# EAGLE schematic USBHostModule (EAGLE 9.6.2)
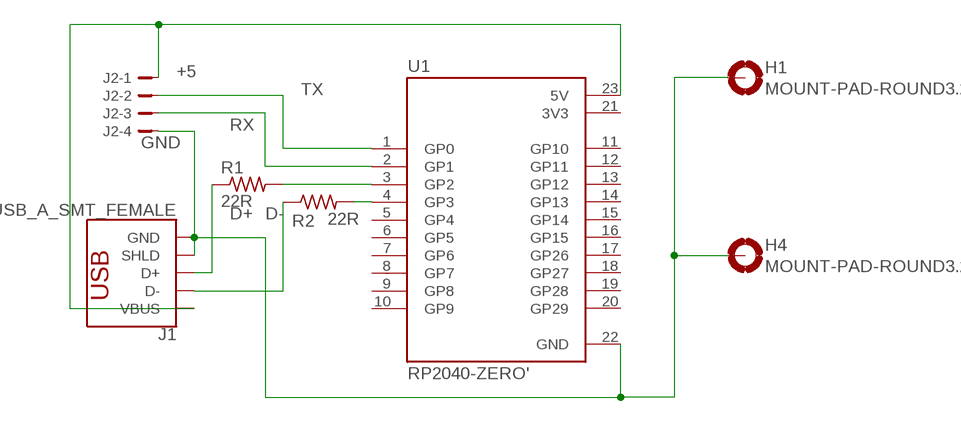
[diagram p0: schematic, sheet 1]

## Parts
H1  MOUNT-PAD-ROUND3.2  [3,2-PAD]
H4  MOUNT-PAD-ROUND3.2  [3,2-PAD]
J1  USB_A_SMT_FEMALE  [USB-A-S-SILK-FEMALE]
J2  JST-PH-4_TH-RA  [S4B-PH-KL]
R1  22R  R-US_R1206  [R1206]
R2  22R  R-US_R1206  [R1206]
U1  RP2040-ZERO'  [MODULE_RP2040-ZERO]

## Nets
+5: J1.VBUS J2.1 U1.23(5V)
D+: J1.D+ R1.1
D-: J1.D- R2.1
GND: H1.B3,2(MOUNT) H4.B3,2(MOUNT) J1.GND J1.SHLD1(SHLD) J1.SHLD2(SHLD) J2.4 U1.22(GND)
N$5: R2.2 U1.4(GP3)
N$6: R1.2 U1.3(GP2)
RX: J2.3 U1.2(GP1)
TX: J2.2 U1.1(GP0)
Unconnected: U1.5(GP4) U1.6(GP5) U1.7(GP6) U1.8(GP7) U1.9(GP8) U1.10(GP9) U1.11(GP10) U1.12(GP11) U1.13(GP12) U1.14(GP13) U1.15(GP14) U1.16(GP15) U1.17(GP26) U1.18(GP27) U1.19(GP28) U1.20(GP29)

## Power pins joined to a net without a drawn wire
3V3: U1.21(3V3)

## Library data of the parts
H1 H4 = holes:MOUNT-PAD-ROUND: MOUNTING PAD, round
J1 = SparkFun-Connectors:USB_A: USB-A Connector Male and female variants, as well as PTH and SMT variants SparkFun Products: SparkFun XBee Explorer Dongle <https://www.sparkfun.com/products/11697> PTH Male SparkFun MicroView-USB Programmer <https://www.sparkfun.com/products/12924> SMT Male SparkFun USB Type A Female Breakout <https://www.sparkfun.com/products/12700> SMT Female; PROD_ID: CONN-09520; SF_ID: PRT-09011
J2 = con-JST-PH:JST-PH-4; MF: JST; MPN: S4B-PH-KL
R1 R2 = adafruit:R-US_: RESISTOR, American symbol
U1 = RP2040-ZERO:RP2040-ZERO: Check availability <https://pricing.snapeda.com/parts/RP2040-ZERO/Waveshare%20Electronics/view-part?ref=eda>; AVAILABILITY: Not in stock; CHECK_PRICES: https://www.snapeda.com/parts/RP2040-ZERO/Waveshare+Electronics/view-part/?ref=eda; DESCRIPTION: Low-Cost, High-Performance Pico-Like MCU Board Based On Raspberry Pi Microcontroller RP2040; MF: Waveshare Electronics; MP: RP2040-ZERO; PACKAGE: Package; PRICE: None; SNAPEDA_LINK: https://www.snapeda.com/parts/RP2040-ZERO/Waveshare+Electronics/view-part/?ref=snap